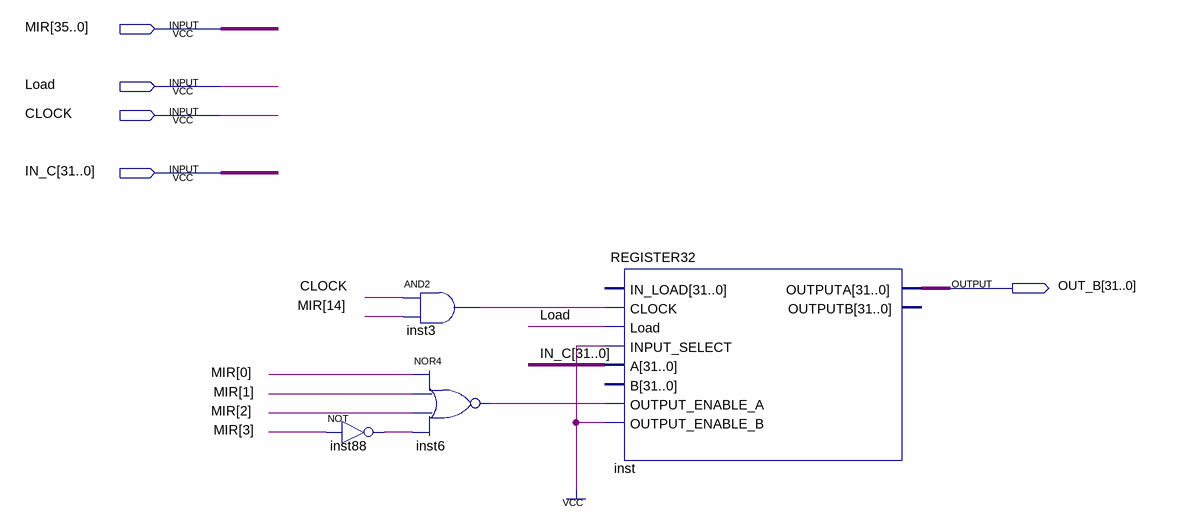
[diagram p0: schematic sheet]
// Quartus schematic OPC.bdf as structural Verilog: 4 symbols, 5 pins
module OPC (
  input  [35:0] MIR,
  input  Load,
  input  CLOCK,
  input  [31:0] IN_C,
  output [31:0] OUT_B
);

  wire inst3_out, inst6_out, inst88_out;

  not inst88 (inst88_out, MIR[3]);
  and inst3 (inst3_out, CLOCK, MIR[14]);
  nor inst6 (inst6_out, MIR[0], MIR[1], MIR[2], inst88_out);
  REGISTER32 inst (
    .CLOCK(inst3_out), .Load(Load), .INPUT_SELECT(1'b1), .A(IN_C), .OUTPUT_ENABLE_A(inst6_out),
    .OUTPUT_ENABLE_B(1'b1), .OUTPUTA(OUT_B));  // open: IN_LOAD, B, OUTPUTB
endmodule
